# Altium schematic sheet sch_substrate_board_ethernet.SchDoc
size A4; SheetNumber: 1; SheetTotal: 6
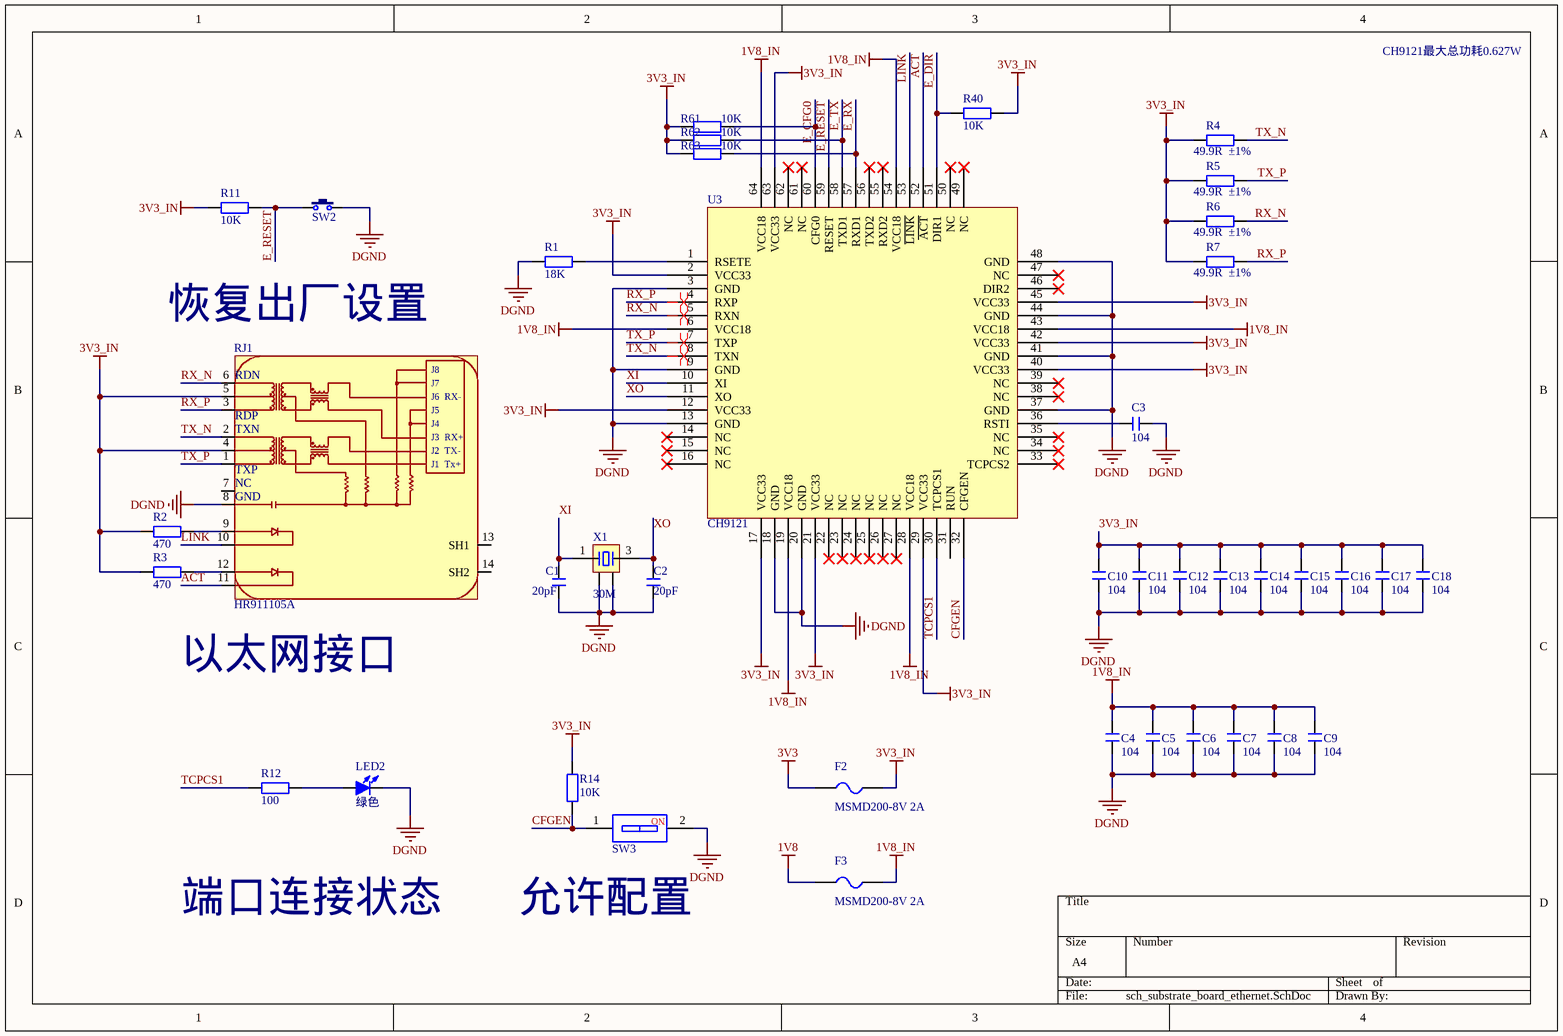
[diagram p0: sch_substrate_board_ethernet.SchDoc]

## Parts
C1  20pF  [C 0805_L]
C2  20pF  [C 0805_L]
C3  104  [C 0805_L]
C4  104  [C 0805_L]
C5  104  [C 0805_L]
C6  104  [C 0805_L]
C7  104  [C 0805_L]
C8  104  [C 0805_L]
C9  104  [C 0805_L]
C10  104  [C 0805_L]
C11  104  [C 0805_L]
C12  104  [C 0805_L]
C13  104  [C 0805_L]
C14  104  [C 0805_L]
C15  104  [C 0805_L]
C16  104  [C 0805_L]
C17  104  [C 0805_L]
C18  104  [C 0805_L]
F2  MSMD200-8V 2A  [FU 0603]
F3  MSMD200-8V 2A  [FU 0603]
LED2  绿色  [LED 0805G]
R1  18K  [R 0805_L]
R2  470  [R 0805_L]
R3  470  [R 0805_L]
R4  49.9R  ±1%  [R 0603_L]
R5  49.9R  ±1%  [R 0603_L]
R6  49.9R  ±1%  [R 0603_L]
R7  49.9R  ±1%  [R 0603_L]
R11  10K  [R 0805_L]
R12  100  [R 0805_L]
R14  10K  [R 0805_L]
R40  10K  [R 0805_L]
R61  10K  [R 0805_L]
R62  10K  [R 0805_L]
R63  10K  [R 0805_L]
RJ1  HR911105A  [RJ45]
SW2  3x6x5  [TSW SMD-3*6*2.5]  (value not drawn)
SW3  SW-1P  [SW-SMD_DSHP01TSGER]  (value not drawn)
U3  CH9121  [CH9121]
X1  30M  [OSC 3225-4P]

## Nets
1V8: F3.1
1V8_IN: C4.2 C5.2 C6.2 C7.2 C8.2 C9.2 F3.2 U3.6(VCC18) U3.19(VCC18) U3.28(VCC18) U3.43(VCC18) U3.54(VCC18) U3.64(VCC18)
3V3: F2.1
3V3_IN: C10.2 C11.2 C12.2 C13.2 C14.2 C15.2 C16.2 C17.2 C18.2 F2.2 R2.1 R3.1 R4.1 R5.1 R6.1 R7.1 R11.2 R14.1 R40.2 R61.2 R62.2 R63.2 RJ1.4 RJ1.5 U3.2(VCC33) U3.12(VCC33) U3.17(VCC33) U3.21(VCC33) U3.29(VCC33) U3.40(VCC33) U3.42(VCC33) U3.45(VCC33) U3.63(VCC33)
DGND: C1.1 C2.1 C3.2 C4.1 C5.1 C6.1 C7.1 C8.1 C9.1 C10.1 C11.1 C12.1 C13.1 C14.1 C15.1 C16.1 C17.1 C18.1 LED2.2(K) R1.1 RJ1.8(GND) SW2.2 SW3.2 U3.3(GND) U3.9(GND) U3.13(GND) U3.18(GND) U3.20(GND) U3.37(GND) U3.41(GND) U3.44(GND) U3.48(GND) X1.2 X1.4
ACT: RJ1.11 U3.52(~{ACT})
CFGEN: R14.2 SW3.1 U3.32(CFGEN)
E_CFG0: R61.1 U3.60(CFG0)
E_DIR: R40.1 U3.51(DIR1)
E_RESET: R11.1 SW2.1 U3.59(RESET)
E_RX: R63.1 U3.57(RXD1)
E_TX: R62.1 U3.58(TXD1)
LINK: RJ1.10 U3.53(~{LINK})
RX_N: R6.2 RJ1.6(RDN) U3.5(RXN)
RX_P: R7.2 RJ1.3(RDP) U3.4(RXP)
TCPCS1: R12.2 U3.30(TCPCS1)
TX_N: R4.2 RJ1.2(TDN) U3.8(TXN)
TX_P: R5.2 RJ1.1(TXP) U3.7(TXP)
XI: C1.2 U3.10(XI) X1.1
XO: C2.2 U3.11(XO) X1.3
NetC3_1: C3.1 U3.36(RSTI)
NetLED2_1: LED2.1(A) R12.1
NetR1_2: R1.2 U3.1(RSETE)
NetR2_2: R2.2 RJ1.9
NetR3_2: R3.2 RJ1.12

Not connected (* = marked no-connect by the designer): RJ1 7(NC) 13(SH1) 14(SH2); U3 14(NC)* 15(NC)* 16(NC)* 22(NC)* 23(NC)* 24(NC)* 25(NC)* 26(NC)* 27(NC)* 31(RUN) 33(TCPCS2)* 34(NC)* 35(NC)* 38(NC)* 39(NC)* 46(DIR2)* 47(NC)* 49(NC)* 50(NC)* 55(RXD2)* 56(TXD2)* 61(NC)* 62(NC)*

## Layout directives
differential pair: RX_N, RX_P, TX_N, TX_P

## Notes on the sheet
- CH9121最大总功耗0.627W
- 恢复出厂设置
- 以太网接口
- 端口连接状态
- 允许配置
- (in symbol HR911105A) J8; J7; J6  RX-; J5; J4; TXN; J3  RX+; J2  TX-; J1  Tx+
- (in symbol SW-1P) NO

## Library data of the parts
C1-C18 = C: 贴片电容; BOM名称: 无极性贴片电容; 淘宝ID: 封装库来自淘宝 ID：黄晶宝石; 联系售后，技术支持: https://shop463601444.taobao.com; 唯一出售店铺网址: https://shop463601444.taobao.com
F2 F3 = FU: 贴片保险丝; 版权归属: 封装库来自淘宝卖家 ID：黄晶宝石; BOM名称: 贴片保险丝; 学习资源: https://shop463601444.taobao.com
LED2 = LED-SMD: 贴片LED; 版权归属: 封装库来自淘宝 ID：黄晶宝石; BOM名称: 贴片LED; 学习资源: https://item.taobao.com/item.htm?id=566775463719
R1-R7 R11 R12 R14 R40 R61-R63 = R: 贴片电阻; 版权归属: 来自淘宝 ID：黄晶宝石; 封装库来自淘宝卖家 ID：黄晶宝石: 其他店铺购入均为盗版，不享受售后技术支持服务，请立即申请退款; BOM名称: 贴片电阻; 联系售后: https://item.taobao.com/item.htm?id=566775463719
SW2 = TSW 3x6: 3x6轻触开关; 学习资源: 最新版本发布https://item.taobao.com/item.htm?id=566775463719; 版权归属: 封装库来自淘宝 ID：黄晶宝石; BOM名称: 3x6轻触开关
SW3 = SW-1P: 1路编码开关; 学习资源: 封装库来自淘宝 ID：黄晶宝石; BOM名称: 1路编码开关; 技术支持，联系售后: https://shop463601444.taobao.com
U3 = CH9121: IC
X1 = XTAL-4P: 4脚无源晶振; 版权归属: 封装库来自淘宝卖家 ID：黄晶宝石; BOM名称: 4脚无源晶振; 学习资源: https://shop463601444.taobao.com